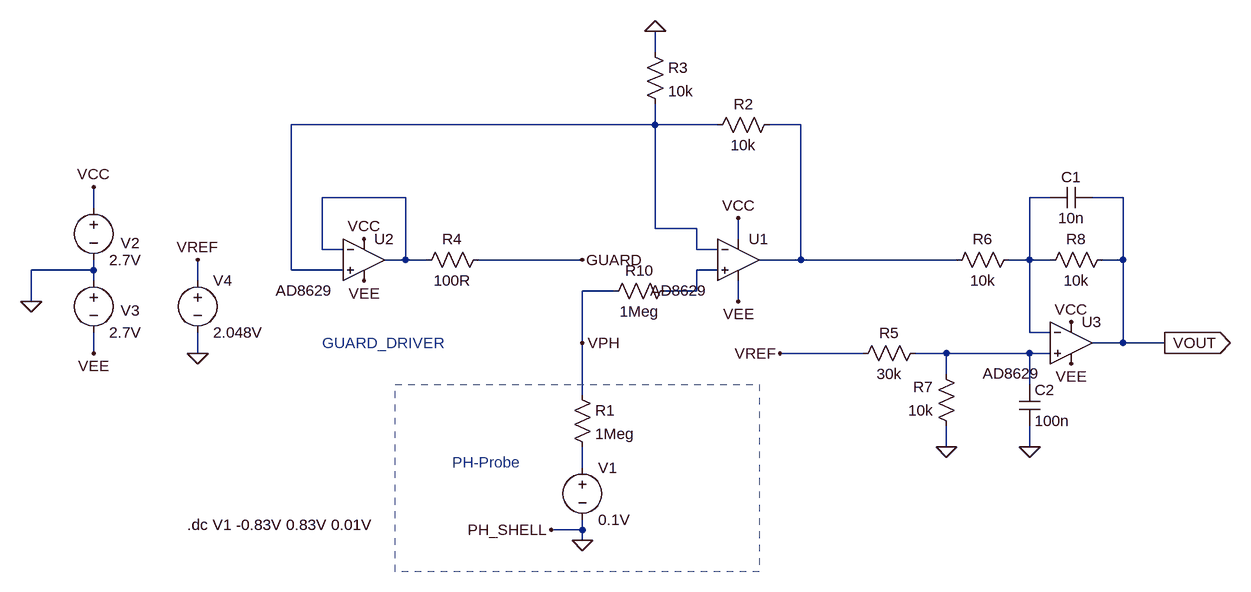
[diagram p0: schematic ph-sim1.asc]
ph-sim1.asc, the LTspice schematic file:
Version 4
SHEET 1 1860 680
WIRE 0 -192 0 -224
WIRE 0 -80 0 -112
WIRE 0 -80 -560 -80
WIRE 96 -80 0 -80
WIRE 224 -80 176 -80
WIRE -384 32 -512 32
WIRE 608 32 576 32
WIRE 720 32 672 32
WIRE -864 48 -864 16
WIRE 0 80 0 -80
WIRE 64 80 0 80
WIRE 128 96 128 64
WIRE -512 112 -512 32
WIRE -480 112 -512 112
WIRE 64 112 64 80
WIRE 96 112 64 112
WIRE -384 128 -384 32
WIRE -384 128 -416 128
WIRE -352 128 -384 128
WIRE -112 128 -272 128
WIRE 224 128 224 -80
WIRE 224 128 160 128
WIRE 464 128 224 128
WIRE 576 128 576 32
WIRE 576 128 544 128
WIRE 608 128 576 128
WIRE 720 128 720 32
WIRE 720 128 688 128
WIRE -864 144 -864 128
WIRE -864 144 -960 144
WIRE -560 144 -560 -80
WIRE -480 144 -560 144
WIRE 96 144 64 144
WIRE -864 160 -864 144
WIRE -704 160 -704 128
WIRE -64 176 -112 176
WIRE 64 176 64 144
WIRE 64 176 16 176
WIRE -960 192 -960 144
WIRE 128 192 128 160
WIRE 576 240 576 128
WIRE 608 240 576 240
WIRE -112 256 -112 176
WIRE 720 256 720 128
WIRE 720 256 672 256
WIRE 784 256 720 256
WIRE -864 272 -864 240
WIRE -704 272 -704 240
WIRE 320 272 192 272
WIRE 448 272 400 272
WIRE 576 272 448 272
WIRE 608 272 576 272
WIRE 448 304 448 272
WIRE 576 320 576 272
WIRE -112 336 -112 256
WIRE 448 416 448 384
WIRE 576 416 576 384
WIRE -112 448 -112 416
WIRE -112 544 -112 528
WIRE -112 544 -160 544
WIRE -112 560 -112 544
FLAG -112 560 0
FLAG -112 128 GUARD
FLAG 128 64 VCC
FLAG 128 192 VEE
FLAG -448 96 VCC
FLAG -448 160 VEE
FLAG 784 256 VOUT
IOPIN 784 256 Out
FLAG -960 192 0
FLAG -864 16 VCC
FLAG -864 272 VEE
FLAG 0 -224 0
FLAG 640 224 VCC
FLAG -704 128 VREF
FLAG 640 288 VEE
FLAG -704 272 0
FLAG -160 544 PH_SHELL
FLAG 192 272 VREF
FLAG 448 416 0
FLAG 576 416 0
FLAG -112 256 VPH
SYMBOL res -128 320 R0
SYMATTR InstName R1
SYMATTR Value 1Meg
SYMBOL voltage -112 432 R0
SYMATTR InstName V1
SYMATTR Value 0.1V
SYMBOL res 192 -96 R90
WINDOW 0 0 56 VBottom 2
WINDOW 3 32 56 VTop 2
SYMATTR InstName R2
SYMATTR Value 10k
SYMATTR SpiceLine tol=0.1
SYMBOL res -16 -208 R0
SYMATTR InstName R3
SYMATTR Value 10k
SYMATTR SpiceLine tol=0.1
SYMBOL res -256 112 R90
WINDOW 0 0 56 VBottom 2
WINDOW 3 32 56 VTop 2
SYMATTR InstName R4
SYMATTR Value 100R
SYMBOL voltage -864 32 R0
WINDOW 0 42 70 Left 2
SYMATTR InstName V2
SYMATTR Value 2.7V
SYMBOL voltage -864 144 R0
WINDOW 0 42 62 Left 2
SYMATTR InstName V3
SYMATTR Value 2.7V
SYMBOL voltage -704 144 R0
SYMATTR InstName V4
SYMATTR Value 2.048V
SYMBOL res 464 400 R180
WINDOW 0 36 76 Left 2
WINDOW 3 36 40 Left 2
SYMATTR InstName R7
SYMATTR Value 10k
SYMATTR SpiceLine tol=0.1
SYMBOL res 560 112 R90
WINDOW 0 0 56 VBottom 2
WINDOW 3 32 56 VTop 2
SYMATTR InstName R6
SYMATTR Value 10k
SYMATTR SpiceLine tol=0.1
SYMBOL res 704 112 R90
WINDOW 0 0 56 VBottom 2
WINDOW 3 32 56 VTop 2
SYMATTR InstName R8
SYMATTR Value 10k
SYMATTR SpiceLine tol=0.1
SYMBOL res 416 256 R90
WINDOW 0 0 56 VBottom 2
WINDOW 3 32 56 VTop 2
SYMATTR InstName R5
SYMATTR Value 30k
SYMATTR SpiceLine tol=0.1
SYMBOL cap 672 16 R90
WINDOW 0 0 32 VBottom 2
WINDOW 3 32 32 VTop 2
SYMATTR InstName C1
SYMATTR Value 10n
SYMBOL cap 560 320 R0
SYMATTR InstName C2
SYMATTR Value 100n
SYMBOL res 32 160 R90
WINDOW 0 0 56 VBottom 2
WINDOW 3 32 56 VTop 2
SYMATTR InstName R10
SYMATTR Value 1Meg
SYMBOL OpAmps\\AD8629 -448 64 R0
WINDOW 3 -136 111 Left 2
SYMATTR InstName U2
SYMBOL OpAmps\\AD8629 128 64 R0
WINDOW 3 -136 111 Left 2
SYMATTR InstName U1
SYMBOL OpAmps\\AD8629 640 192 R0
WINDOW 3 -136 111 Left 2
SYMATTR InstName U3
TEXT -512 256 Left 2 ;GUARD_DRIVER
TEXT -312 440 Left 2 ;PH-Probe
TEXT -720 536 Left 2 !.dc V1 -0.83V 0.83V 0.01V
RECTANGLE Normal 160 608 -400 320 2

The netlist it stands for:
* ph-sim1.asc
R1 VPH N007 1Meg
V1 N007 0 0.1V
R2 N002 N001 10k tol=0.1
R3 0 N001 10k tol=0.1
R4 GUARD N003 100R
V2 VCC 0 2.7V
V3 0 VEE 2.7V
V4 VREF 0 2.048V
R7 0 N006 10k tol=0.1
R6 N004 N002 10k tol=0.1
R8 VOUT N004 10k tol=0.1
R5 N006 VREF 30k tol=0.1
C1 VOUT N004 10n
C2 N006 0 100n
R10 N005 VPH 1Meg
XU2 N001 N003 VCC VEE N003 AD8629  ; pins In+ In- V+ V- OUT
XU1 N005 N001 VCC VEE N002 AD8629  ; pins In+ In- V+ V- OUT
XU3 N006 N004 VCC VEE VOUT AD8629  ; pins In+ In- V+ V- OUT
* GUARD_DRIVER
* PH-Probe
.dc V1 -0.83V 0.83V 0.01V
.backanno
.end